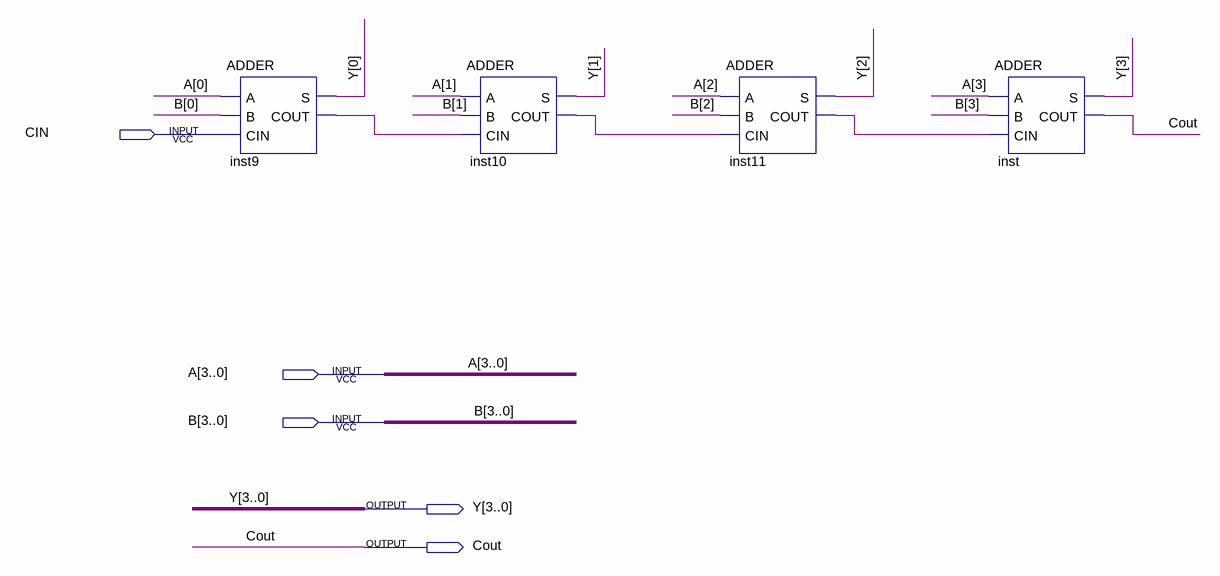
[diagram p0: schematic sheet]
// Quartus schematic ADDER4bit.bdf as structural Verilog: 4 symbols, 5 pins
module ADDER4bit (
  input  CIN,
  input  [3:0] A,
  input  [3:0] B,
  output [3:0] Y,
  output Cout
);

  wire inst9_cout, inst10_cout, inst11_cout;

  ADDER inst9 (.A(A[0]), .B(B[0]), .CIN(CIN), .S(Y[0]), .COUT(inst9_cout));
  ADDER inst10 (.A(A[1]), .B(B[1]), .CIN(inst9_cout), .S(Y[1]), .COUT(inst10_cout));
  ADDER inst11 (.A(A[2]), .B(B[2]), .CIN(inst10_cout), .S(Y[2]), .COUT(inst11_cout));
  ADDER inst (.A(A[3]), .B(B[3]), .CIN(inst11_cout), .S(Y[3]), .COUT(Cout));
endmodule
